# Altium project IO BOARD CERES-V3.PrjPcb (part 2 of 2)

## Sheet SATELLITE_2.SchDoc: SCHEMA
size A4; Date: 01/01/2000; Author: Rachid AKKOUCHE; CompanyName: RASoftware; DrawnBy: Rachid AKKOUCHE; Engineer: Rachid AKKOUCHE; Organization: RASoftware; Address1: 52J-03 rue de la crèche; Address3: 77100 MEAUX; Address4: FRANCE; DocumentNumber: 01; Revision: A; SheetNumber: 1; SheetTotal: 1; Dessinepar: Rachid AKKOUCHE; Property: RASoftware; Time: 00:00; ProjectName: Projet BRA; Application_BuildNumber: 01
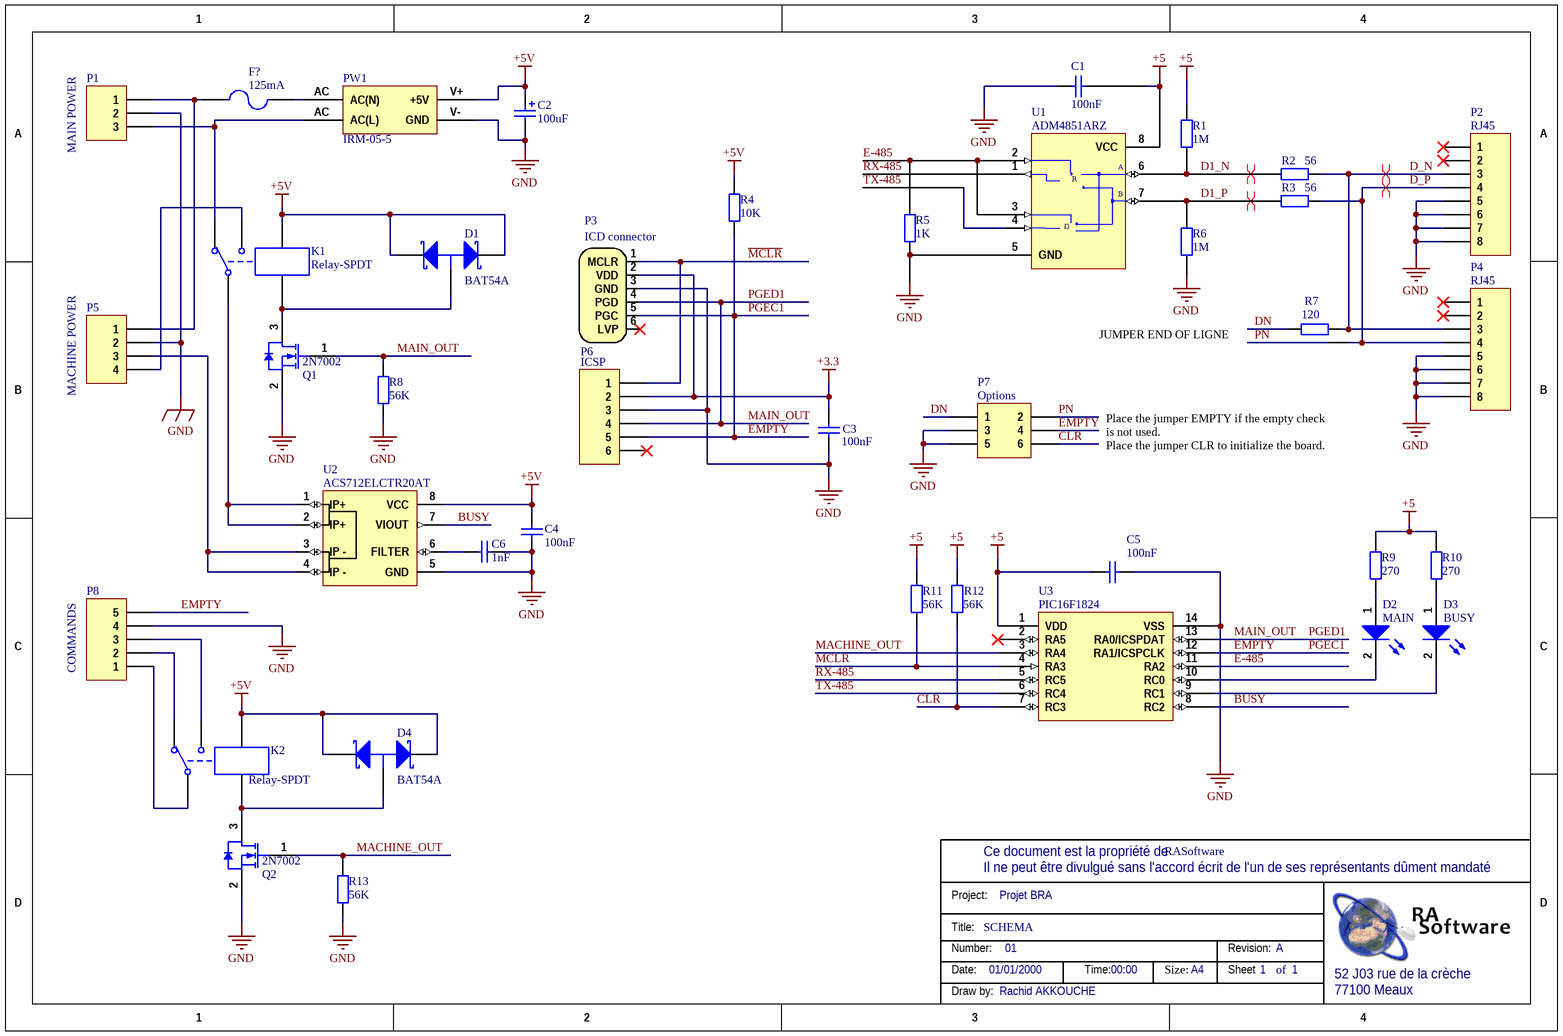
[diagram p5: SATELLITE_2.SchDoc]

### Parts
(Parts that share a designator on the sheet are numbered #1, #2 ... from top to bottom, then left to right.)
C1#2  100nF  [C0805]
C2#2  100uF  [Kemet_63]
C3  100nF  [C0805]
C4#2  100nF  [C0805]
C5#2  100nF  [C0805]
C6#2  1nF  [C0805]
D1#3  BAT54A  [sot-23]
D2#2  Indicator: MAIN  [0603-LEDV]  (hidden comment: HSMH-C190)
D3  Indicator: BUSY  [0603-LEDR]  (hidden comment: HSMH-C190)
D4  BAT54A  [sot-23]
F?  125mA  [FUS5X20]
K1#3  Relay-SPDT  [MODULE5B]
K2#2  Relay-SPDT  [MODULE5B]
P1#3  MAIN POWER  [HDR1X3]
P2#3  RJ45  [Amphenol-RJ45_8]
P3#2  ICD connector  [TC2030]  (no BOM)
P4#3  RJ45  [Amphenol-RJ45_8]
P5#3  MACHINE POWER  [HDR1X4]
P6#3  M20-8770642  [M20_1X6]  (value not drawn)
P7#3  Options  [HDR2X3]
P8#2  COMMANDS  [HDR1X5]
PW1  IRM-05-5
Q1#2  2N7002  [SOT23]
Q2#2  2N7002  [SOT23]
R1#2  1M  [R0805]
R2#2  56  [R0805]
R3#2  56  [R0805]
R4  10K  [R0805]
R5#2  1K  [R0805]
R6  1M  [R0805]
R7#2  120  [R0805]
R8#2  56K  [R0805]
R9#2  270  [R0805]
R10#2  270  [R0805]
R11#2  56K  [R0805]
R12#2  56K  [R0805]
R13#2  56K  [R0805]
U1#2  ADM4851ARZ  [SOIC8]
U2#2  Supplier Part Number 1: ACS712ELCTR20AT  [NSO8_L]  (hidden comment: ACS712)
U3#2  PIC16F1824  [so-14]

### Nets
+3.3: C3.2 P3#2.2(VDD) P6#3.2
+5: C1#2.1 C5#2.2 R1#2.2 R9#2.2 R10#2.2 R11#2.2 R12#2.2 U1#2.8(VCC) U3#2.1(VDD)
+5V: C2#2.1 C4#2.2 D1#3.1(K1) D1#3.2(K2) D4.1(K1) D4.2(K2) K1#3.5 K2#2.5 PW1.V+(+5V) R4.2 U2#2.8(VCC)
GND: C1#2.2 C2#2.2 C3.1 C4#2.1 C5#2.1 C6#2.2 P1#3.2 P2#3.5 P2#3.6 P2#3.7 P2#3.8 P3#2.3(GND) P4#3.5 P4#3.6 P4#3.7 P4#3.8 P5#3.2 P6#3.3 P7#3.3 P7#3.5 P8#2.4 PW1.V-(GND) Q1#2.2(S) Q2#2.2(S) R5#2.1 R6.1 R8#2.1 R13#2.1 U1#2.5(GND) U2#2.5(GND) U3#2.14(VSS)
~{MCLR}: R11#2.1 U3#2.4(RA3)
BUSY: U2#2.7(VIOUT) U3#2.8(RC2)
CLR: P7#3.6 R12#2.1 U3#2.7(RC3)
D1_N: R1#2.1 R2#2.1 U1#2.6(A)
D1_P: R3#2.1 R6.2 U1#2.7(B)
D_N: P2#3.3 P4#3.3 R2#2.2 R7#2.1
D_P: P2#3.4 P4#3.4 P7#3.2 R3#2.2  [also labelled PN]
DN: P7#3.1 R7#2.2
E-485: R5#2.2 U1#2.2(~{RE}) U1#2.3(DE) U3#2.11(RA2)
EMPTY: P3#2.5(PGC) P6#3.5 P7#3.4 P8#2.5 R4.1 U3#2.12(RA1/ICSPCLK)  [also labelled PGEC1]
~{MCLR}: P3#2.1(MCLR) P6#3.1  [a separate net that carries the same name]
MACHINE_OUT: Q2#2.1(G) R13#2.2 U3#2.3(RA4)
MAIN_OUT: P3#2.4(PGD) P6#3.4 Q1#2.1(G) R8#2.2 U3#2.13(RA0/ICSPDAT)  [also labelled PGED1]
RX-485: U1#2.1(RO) U3#2.5(RC5)
TX-485: U1#2.4(DI) U3#2.6(RC4)
NetC6#2_1: C6#2.1 U2#2.6(FILTER)
NetD1#3_3: D1#3.3(A) K1#3.4 Q1#2.3(D)
NetD2#2_1: D2#2.1(A) R9#2.1
NetD2#2_2: D2#2.2(K) U3#2.10(RC0)
NetD3_1: D3.1(A) R10#2.1
NetD3_2: D3.2(K) U3#2.9(RC1)
NetD4_3: D4.3(A) K2#2.4 Q2#2.3(D)
NetF?_1: F?.1 P1#3.1 P5#3.1
NetF?_2: F?.2 PW1.AC(AC(N))
NetK1#3_1: K1#3.1 U2#2.1(IP+) U2#2.2(IP+)
NetK1#3_2: K1#3.2 P1#3.3 PW1.AC(AC(L))
NetK1#3_3: K1#3.3 P5#3.4
NetK2#2_1: K2#2.1 P8#2.1
NetK2#2_2: K2#2.2 P8#2.2
NetK2#2_3: K2#2.3 P8#2.3
NetP5#3_3: P5#3.3 U2#2.3(IP_-) U2#2.4(IP_-)

Not connected (* = marked no-connect by the designer): P2#3 1* 2*; P3#2 6(LVP)*; P4#3 1* 2*; P6#3 6*; U3#2 2(RA5)*

### Layout directives
differential pair: D1_N, D1_P, D_N, D_P

### Notes on the sheet
- JUMPER END OF LIGNE
- Place the jumper EMPTY if the empty check is not used.
  Place the jumper CLR to initialize the board.
- Ce document est la propriété de
- Project:
- Il ne peut être divulgué sans l'accord écrit de l'un de ses représentants dûment mandaté
- Title:
- Number:
- Date:
- Time:
- Size:
- A4
- Revision:
- Sheet
- of
- 52 J03 rue de la crèche
- Draw by:
- 77100 Meaux
- (in symbol Header 6) ICSP
- (in symbol MAX485ESA) R; D

### Library data of the parts
C1#2 C3 C4#2 C5#2 = Cap 0805 100nF: Capacitor; Manufacturer: MULTICOMP; Manufacturer Part Number: MCCA000296; Supplier 1: Farnell; Supplier Part Number 1: 1759167; Pricing 1: 100=0,01, 500=0,008, 1000=0,006, 4000=0,005 (EUR); ComponentLink1URL: http://www.farnell.com/datasheets/1520827.pdf; ComponentLink1Description: http://www.farnell.com/datasheets/1520827.pdf
C2#2 = Cap Pol 100uF: Polarized Capacitor; Manufacturer: EPCOS; Manufacturer Part Number: B41142A4107M; Product Range: EPCOS - B41142 Series; Capacité: 100; Tolérance de capacité: ± 20%; Tension: 16; Type de boîtier de condensateur: Radial Can - SMD; Diamètre: 6.3; Résistance, ESR: 0.16; Hauteur: 7.7; Courant d'ondulation c.a.: 300; Type de packaging: Cut Tape; Durée de vie @ température: 2000 heures @ 105; Température d'utilisation min: -55; Température de fonctionnement max..: 105; SVHC: No SVHC (19-Dec-2012); Impédance: 0.26; Température de fonctionnement: -55°C à +105; Température, ESR: 20; Type de boîtier: CMS; Supplier 1: Farnell; RoHS: YES; Pricing 1: 10=0,123, 50=0,095, 100=0,078, 250=0,07, 1000=0,062 (EUR); Courant d'ondulation c.a. à  100Hz: 300; Fréquence, impédance: 100; Longueur/hauteur: 7.7; Température, courant ondulatoire: 105; Température, impédance: 20; ComponentLink1URL: http://www.epcos.com/inf/20/30/db/alu_x/B41142.pdf; ComponentLink1Description: http://www.epcos.com/inf/20/30/db/alu_x/B41142.pdf; Supplier Part Number 1: 1735328
C6#2 = Cap 0805 1nF: Capacitor; Manufacturer: SAMSUNG; Manufacturer Part Number: CL05B102KB5NNNC; Unit: pcs; SuppliedAmount: 10000; MinAmount: 300; Multiples: 100; Type de condensateur: céramique; Tye de condensateur: MLCC; Tension de travail: 50V; Diélectrique: X7R; Tolérance: ±10%; Montage: SMD; Boîtier: 0402; Température de travail: -55...125°C; Supplier 1: TME; Category: Condensateurs MLCC SMD 0402; Stock 1: 25000; Pricing 1: 300=0,00208, 1000=0,00124, 10000=0,00069, 40000=0,00066, 100000=0,00064 (EUR); Weight: 0,012; Price Type: NET; Capacité: 1nF; Fabricant: SAMSUNG; ComponentLink1URL: http://www.tme.eu/fr/details/cl05b102kb5nnnc/condensateurs-mlcc-smd-0402/samsung/; ComponentLink1Description: http://www.tme.eu/fr/details/cl05b102kb5nnnc/condensateurs-mlcc-smd-0402/samsung/; Supplier Part Number 1: CL05B102KB5NNNC
D1#3 D4 = BAT54A: Schottky Barrier Double Diode; Manufacturer: FAIRCHILD SEMICONDUCTOR; Courant, If moy.: 200; Tension, Vrrm: 30; Tension, Vf max..: 320; Temps trr max.: 5; Courant, Ifs max.: 600; Température d'utilisation min: -55; Température de fonctionnement max..: 150; Nombre de broches: 3; SVHC: No SVHC (20-Jun-2013); Configuration diode: Double anode commune; Courant, If, Vf: 1; Marquage, CMS: L42; Température de fonctionnement: -55°C à +150; Type de terminaison: SMD; Supplier 1: Farnell; Supplier Part Number 1: 1228222; Manufacturer Part Number: BAT54A; RoHS: YES; Pricing 1: 5=0,084, 25=0,082, 100=0,036, 1000=0,032, 3000=0,03 (EUR); Diode Type: Schottky; Type de boîtier diode: SOT-23; MSL: MSL 1 - Illimité; Température, Tj max..: 150; Type de boîtier: SOT-23; courant Ifsm: 600; ComponentLink1URL: http://www.farnell.com/datasheets/1718084.pdf; ComponentLink1Description: http://www.farnell.com/datasheets/1718084.pdf; ComponentLink2URL: http://www.farnell.com/datasheets/410597.pdf; ComponentLink2Description: http://www.farnell.com/datasheets/410597.pdf
D2#2 D3 = HSMH-C190: Surface Mount Chip LED, Red; Manufacturer: AVAGO TECHNOLOGIES; Manufacturer Part Number: HSMH-C190.; Taille de lampe: 0.8mm x 1; Couleur de LED: Rouge; Intensité lumineuse: 17; Angle, vision: 170°; Courant, direct, If: 20; Tension, direct à  If: 1.8; Montage LED: CMS; Forme de lentille: Rectangulaire; Longueur d'onde typ.: 626; SVHC: No SVHC (19-Dec-2012); Dissipation de puissance: 65; Intensité lumineuse min. à  If: 2.8; Intensité lumineuse typique: 10; Largeur (externe): 0.8; Longueur d'onde dominante: 639; Longueur d'onde, crête: 630; Longueur/hauteur: 1.6; Matière: AlGaAs; Nombre de broches: 2; Orientation de montage opto: Dessus; Orientation sortie de lumière: Top Emitting; Température de fonctionnement: -30°C à +85; Température de fonctionnement max..: 85; Température, stockage min.: -40; Température d'utilisation min: -30; Tension, Vf max..: 2.6; Tension, Vf min.: 2.1; Type de LED: Standard; Supplier 1: Farnell; Supplier Part Number 1: 8554641; RoHS: YES; Pricing 1: 5=0,06, 25=0,059, 100=0,057, 250=0,052, 500=0,047 (EUR); MSL: MSL 2A - 4 semaines; Couleur, LED: Rouge; Profondeur: 0.8; Température, stockage max..: 85; Tension, Vf typ.: 1.8; ComponentLink1URL: http://www.farnell.com/datasheets/313031.pdf; ComponentLink1Description: http://www.farnell.com/datasheets/313031.pdf; ComponentLink2URL: http://www.farnell.com/datasheets/55927.pdf; ComponentLink2Description: http://www.farnell.com/datasheets/55927.pdf; Couleur: RED
F? = Fuse 2: Fuse; Manufacturer: KEYSTONE; Manufacturer Part Number: 4527; Fusible 5X20: 1123209; Published: 8-Jun-2000; LatestRevisionDate: 17-Jul-2002; LatestRevisionNote: Re-released for DXP Platform.; PackageReference: PIN-W2/E2.8; Publisher: Altium Limited; PackageDescription: Thru-Hole; 2 Leads; Supplier 1: Farnell; Supplier Part Number 1: 2301274+2301275+1123183; RoHS: YES; Pricing 1: 1=0,59, 250=0,45, 500=0,4, 1000=0,36, 5000=0,33 (EUR); ComponentLink1URL: http://www.keyelco.com/userAssets/file/M60p42.pdf; ComponentLink1Description: http://www.keyelco.com/userAssets/file/M60p42.pdf
K1#3 K2#2 = Relay-SPDT: Single-Pole Dual-Throw Relay; Manufacturer: OMRON ELECTRONIC COMPONENTS; Manufacturer Part Number: G5LA-1 5DC; Description: OMRON ELECTRONIC COMPONENTS - G5LA-1 5DC - RELAIS SPDT, 277VAC, 30VDC, 10A; Supplier 1: Farnell; Supplier Part Number 1: 1455502; RoHS: YES; Stock 1: 28369; ComponentLink1URL: http://www.farnell.com/datasheets/1683362.pdf; ComponentLink1Description: http://www.farnell.com/datasheets/1683362.pdf
  K2#2: Pricing 1: 1=0,404, 20=0,396, 100=0,388, 250=0,38, 500=0,372, 3000=0,365, 7000=0,358, 20000=0,351 (EUR)
P1#3 = Header 3: Header, 3-Pin; LatestRevisionDate: 17-Jul-2002; LatestRevisionNote: Re-released for DXP Platform.; Publisher: Altium Limited
P2#3 P4#3 = Header 8: Header, 8-Pin; Manufacturer: MOLEX; Manufacturer Part Number: 85502-5008; Supplier 1: Farnell; Supplier Part Number 1: 1331561; RoHS: YES; Pricing 1: 1=1,34, 10=0,873, 50=0,797, 100=0,662, 200=0,597, 500=0,541, 500=0,496, 5000=0,493 (EUR); ComponentLink1URL: http://www.farnell.com/cad/1712028.pdf; ComponentLink1Description: http://www.farnell.com/cad/1712028.pdf; ComponentLink2URL: http://www.farnell.com/datasheets/1827260.pdf; ComponentLink2Description: http://www.farnell.com/datasheets/1827260.pdf
P3#2 = TC2030-MCP-NL: Conector par ICD
P5#3 = Header 4: Header, 4-Pin; LatestRevisionDate: 17-Jul-2002; LatestRevisionNote: Re-released for DXP Platform.; Publisher: Altium Limited
P6#3 = Header 6: Header, 6-Pin; Manufacturer: HARWIN; Type de connecteur: Contact fil-à-carte; Série: M20; Terminaison du contact: Montage en surface vertical; Genre: Embase; Nombre de contacts: 6; Nombre de rangées: 1; Pas: 2.54; Plaquage du contact: Or; Matériau du contact: Laiton; SVHC: No SVHC (19-Dec-2012); Supplier 1: Farnell; Supplier Part Number 1: 1517384; Manufacturer Part Number: M20-8770642; RoHS: YES; Stock 1: 3471; Pricing 1: 10=0,69, 20=0,66, 50=0,62, 100=0,6, 250=0,56, 500=0,49 (EUR); Pas, rang: 2.54; ComponentLink1URL: http://www.farnell.com/datasheets/1089524.pdf; ComponentLink1Description: http://www.farnell.com/datasheets/1089524.pdf; ComponentLink2URL: http://www.farnell.com/datasheets/5481.pdf; ComponentLink2Description: http://www.farnell.com/datasheets/5481.pdf
P7#3 = Header 3X2: Header, 3-Pin, Dual row; LatestRevisionDate: 17-Jul-2002; LatestRevisionNote: Re-released for DXP Platform.; Publisher: Altium Limited
P8#2 = Header 5: Header, 5-Pin; LatestRevisionDate: 17-Jul-2002; LatestRevisionNote: Re-released for DXP Platform.; Publisher: Altium Limited
PW1 = IRM-05-5: POWER SUPPLY 5V 1A
Q1#2 Q2#2 = 2N7002: N-channel Enhancement Mode Field-effect Transistor; Manufacturer: FAIRCHILD SEMICONDUCTOR; Supplier 1: Farnell; Supplier Part Number 1: 9845313; Manufacturer Part Number: 2N7002; RoHS: YES; Pricing 1: 5=0,138, 25=0,13, 100=0,059, 1000=0,049, 3000=0,026, 6000=0,0234 (EUR); ComponentLink1URL: http://www.farnell.com/datasheets/660093.pdf; ComponentLink1Description: http://www.farnell.com/datasheets/660093.pdf; ComponentLink2URL: http://www.farnell.com/datasheets/410597.pdf; ComponentLink2Description: http://www.farnell.com/datasheets/410597.pdf
R1#2 R6 = Resistor 0805 1M: Resistor
R2#2 R3#2 = Resistor 0805 56: Resistor; Manufacturer: MULTICOMP; Manufacturer Part Number: MC01W0805156R; Product Range: MULTICOMP - MC Series; Puissance: 100; Tolérance de résistance: ± 1%; Type de boîtier de résistance: 0805; Type de résistance: Couche épaisse; Coefficient de température: ± 200; Tension: 150; Type de packaging: Full Reel; SVHC: No SVHC (20-Jun-2013); Resistor Mounting: CMS; Supplier 1: Farnell; RoHS: YES; Pricing 1: 5000=0,001 (EUR); Résistance: 56; MSL: (Non Applicable); ComponentLink1URL: http://www.farnell.com/datasheets/1729047.pdf; ComponentLink1Description: http://www.farnell.com/datasheets/1729047.pdf; Supplier Part Number 1: 2129016
R4 = Resistor 0805 10K: Resistor; Manufacturer: MULTICOMP; Manufacturer Part Number: MC0.1W08051%10KFR; Product Range: MULTICOMP - MC Series; Résistance: 10; Puissance: 100; Tolérance de résistance: ± 1%; Type de boîtier de résistance: 0805; Type de résistance: Couche épaisse; Coefficient de température: ± 100; Tension: 150; Type de packaging: Full Reel; Resistor Mounting: CMS; Supplier 1: Farnell; RoHS: YES; Pricing 1: 5000=0,001 (EUR); MSL: MSL 1 - Illimité; ComponentLink1URL: http://www.farnell.com/datasheets/1716700.pdf; ComponentLink1Description: http://www.farnell.com/datasheets/1716700.pdf; Supplier Part Number 1: 2129195
R5#2 = Resistor 0805 1K: Resistor; Manufacturer: MULTICOMP; Manufacturer Part Number: MC0.1W08051%1KFR; Product Range: MULTICOMP - MC Series; Résistance: 1; Puissance: 100; Tolérance de résistance: ± 1%; Type de boîtier de résistance: 0805; Type de résistance: Couche épaisse; Coefficient de température: ± 100; Tension: 150; Type de packaging: Full Reel; Resistor Mounting: CMS; Supplier 1: Farnell; RoHS: YES; Pricing 1: 5000=0,001 (EUR); MSL: MSL 1 - Illimité; ComponentLink1URL: http://www.farnell.com/datasheets/1716700.pdf; ComponentLink1Description: http://www.farnell.com/datasheets/1716700.pdf; Supplier Part Number 1: 2129113
R7#2 = Resistor 0805 120: Resistor; Manufacturer: MULTICOMP; Manufacturer Part Number: MC01W080516K49; Product Range: MULTICOMP - MC Series; Résistance: 6.49; Puissance: 100; Tolérance de résistance: ± 1%; Type de boîtier de résistance: 0805; Type de résistance: Couche épaisse; Coefficient de température: ± 100; Tension: 150; Type de packaging: Full Reel; SVHC: No SVHC (20-Jun-2013); Resistor Mounting: CMS; Supplier 1: Farnell; RoHS: YES; Pricing 1: 5000=0,001 (EUR); MSL: (Non Applicable); ComponentLink1URL: http://www.farnell.com/datasheets/1729047.pdf; ComponentLink1Description: http://www.farnell.com/datasheets/1729047.pdf; Supplier Part Number 1: 2129181
R8#2 R11#2 R12#2 R13#2 = Resistor 0805 56K: Resistor; Manufacturer: MULTICOMP; Manufacturer Part Number: MC0.1W08051%56KFR; Product Range: MULTICOMP - MC Series; Résistance: 56; Puissance: 100; Tolérance de résistance: ± 1%; Type de boîtier de résistance: 0805; Type de résistance: Couche épaisse; Coefficient de température: ± 100; Tension: 150; Type de packaging: Full Reel; Resistor Mounting: CMS; Resistor Terminals: (Non Disponible); Supplier 1: Farnell; RoHS: YES; Pricing 1: 5000=0,001 (EUR); MSL: (Non Applicable); ComponentLink1URL: http://www.farnell.com/datasheets/1716700.pdf; ComponentLink1Description: http://www.farnell.com/datasheets/1716700.pdf; Supplier Part Number 1: 2129258
R9#2 R10#2 = Resistor 0805 270: Resistor; Manufacturer: MULTICOMP; Manufacturer Part Number: MC01W08051270R; Product Range: MULTICOMP - MC Series; Puissance: 100; Tolérance de résistance: ± 1%; Type de boîtier de résistance: 0805; Type de résistance: Couche épaisse; Coefficient de température: ± 100; Tension: 150; Type de packaging: Full Reel; SVHC: No SVHC (20-Jun-2013); Resistor Mounting: CMS; Supplier 1: Farnell; RoHS: YES; Pricing 1: 5000=0,001 (EUR); Résistance: 270; MSL: (Non Applicable); ComponentLink1URL: http://www.farnell.com/datasheets/1729047.pdf; ComponentLink1Description: http://www.farnell.com/datasheets/1729047.pdf; Supplier Part Number 1: 2129067
U1#2 = MAX485ESA: Low-Power, Slew-Rate-Limited RS-485/RS-422 Transceiver; Manufacturer: ANALOG DEVICES; Type de driver: Émetteur-récepteur de ligne différentiel; Type d'interface CI: RS422, RS485; Nombre de drivers: 1; Tension, alimentation min.: 4.75; Tension, alimentation max..: 5.25; Type de boîtier CI Driver: NSOIC; Nombre de broches: 8; Température d'utilisation min: -40; Température de fonctionnement max..: 85; SVHC: No SVHC (20-Jun-2013); Supplier 1: Farnell; Supplier Part Number 1: 2313594; Manufacturer Part Number: ADM4851ARZ; RoHS: YES; Pricing 1: 1=1,39, 10=1,13, 100=1,01, 250=0,9, 500=0,79 (EUR); MSL: MSL 1 - Illimité; ComponentLink1URL: http://www.analog.com/static/imported-files/data_sheets/ADM4850_4851_4852_4853_4854_4855_4856_4857.pdf; ComponentLink1Description: http://www.analog.com/static/imported-files/data_sheets/ADM4850_4851_4852_4853_4854_4855_4856_4857.pdf; ComponentLink2URL: http://www.farnell.com/cad/1713403.zip; ComponentLink2Description: http://www.farnell.com/cad/1713403.zip
U2#2 = ACS712: HALL EFFECT CURRENT SENSOR; Manufacturer: ALLEGRO MICROSYSTEMS; Manufacturer Part Number: ACS712ELCTR-20A-T; Unit: pcs; SuppliedAmount: 10; MinAmount: 1; Type de capteur: Hall effet; Tension d'alimentation: 8V DC; Courant d'entrée: ± 20A; Température de travail: -40...85°C; Supplier 1: TME; Category: Capteurs de Hall; Stock 1: 844; Pricing 1: 1=3,39, 3=3,16, 10=2,92 (EUR); Weight: 0,336; Multiples: 1; Price Type: NET; Fabricant: ALLEGRO MICROSYSTEMS; ComponentLink1URL: http://www.tme.eu/fr/details/acs712elctr20at/capteurs-de-hall/allegro-microsystems/acs712elctr-20a-t/; ComponentLink1Description: http://www.tme.eu/fr/details/acs712elctr20at/capteurs-de-hall/allegro-microsystems/acs712elctr-20a-t/
U3#2 = PIC16(L)F1824: 14 Pin Flash Microcontrollers with XLP Technology; Manufacturer: MICROCHIP; Manufacturer Part Number: PIC16F1824-I/SL; Supplier 1: Farnell; RoHS: YES; Stock 1: 516; ComponentLink1URL: http://www.farnell.com/datasheets/1669488.pdf; ComponentLink1Description: http://www.farnell.com/datasheets/1669488.pdf; ComponentLink2URL: http://www.farnell.com/cad/1689044.zip; ComponentLink2Description: http://www.farnell.com/cad/1689044.zip; Supplier Part Number 1: 1814945

## Nets that join several sheets
+5: MCU IO (11 pins), RS485 IO (C8.1 R15.2 U5.8), IO (C9.2 P2#1.4 U2#1.8), SATELLITE_2 (9 pins)
+12/485: MCU IO (C7.1 P7#1.2 U4.3), RS485 IO (P10.1 P10.3 P11.1 P11.3), IO (6 pins), TEST_BENCH (D1#2.2 J7.1 J7.3 K1#2.3)
GND: MCU IO (13 pins), RS485 IO (10 pins), IO (17 pins), TEST_BENCH (J3.8 J7.5 J7.8), SATELLITE_2 (31 pins)
NetC2#1_1: MCU IO (R8#1.1 U3#1.2), IO (C2#1.1 U1#1.4)
NetQ2#1_1: MCU IO (U3#1.3), IO (Q2#1.1 R21.2)
NetR18_2: MCU IO (U3#1.11), RS485 IO (R18.2 U5.2 U5.3)
NetU2#1_7: MCU IO (U3#1.8), IO (U2#1.7)
NetU3#1_5: MCU IO (U3#1.5), RS485 IO (U5.1)
NetU3#1_6: MCU IO (U3#1.6), RS485 IO (U5.4)
PGEC1: MCU IO (P4#1.5 P6#1.5 U3#1.12), IO (R22.1)
PGED1: MCU IO (P4#1.4 P6#1.4 U3#1.13), IO (Q1#1.1 R5#1.2)